# Altium schematic sheet uC.SchDoc
size A3; SheetNumber: 2; SheetTotal: 7
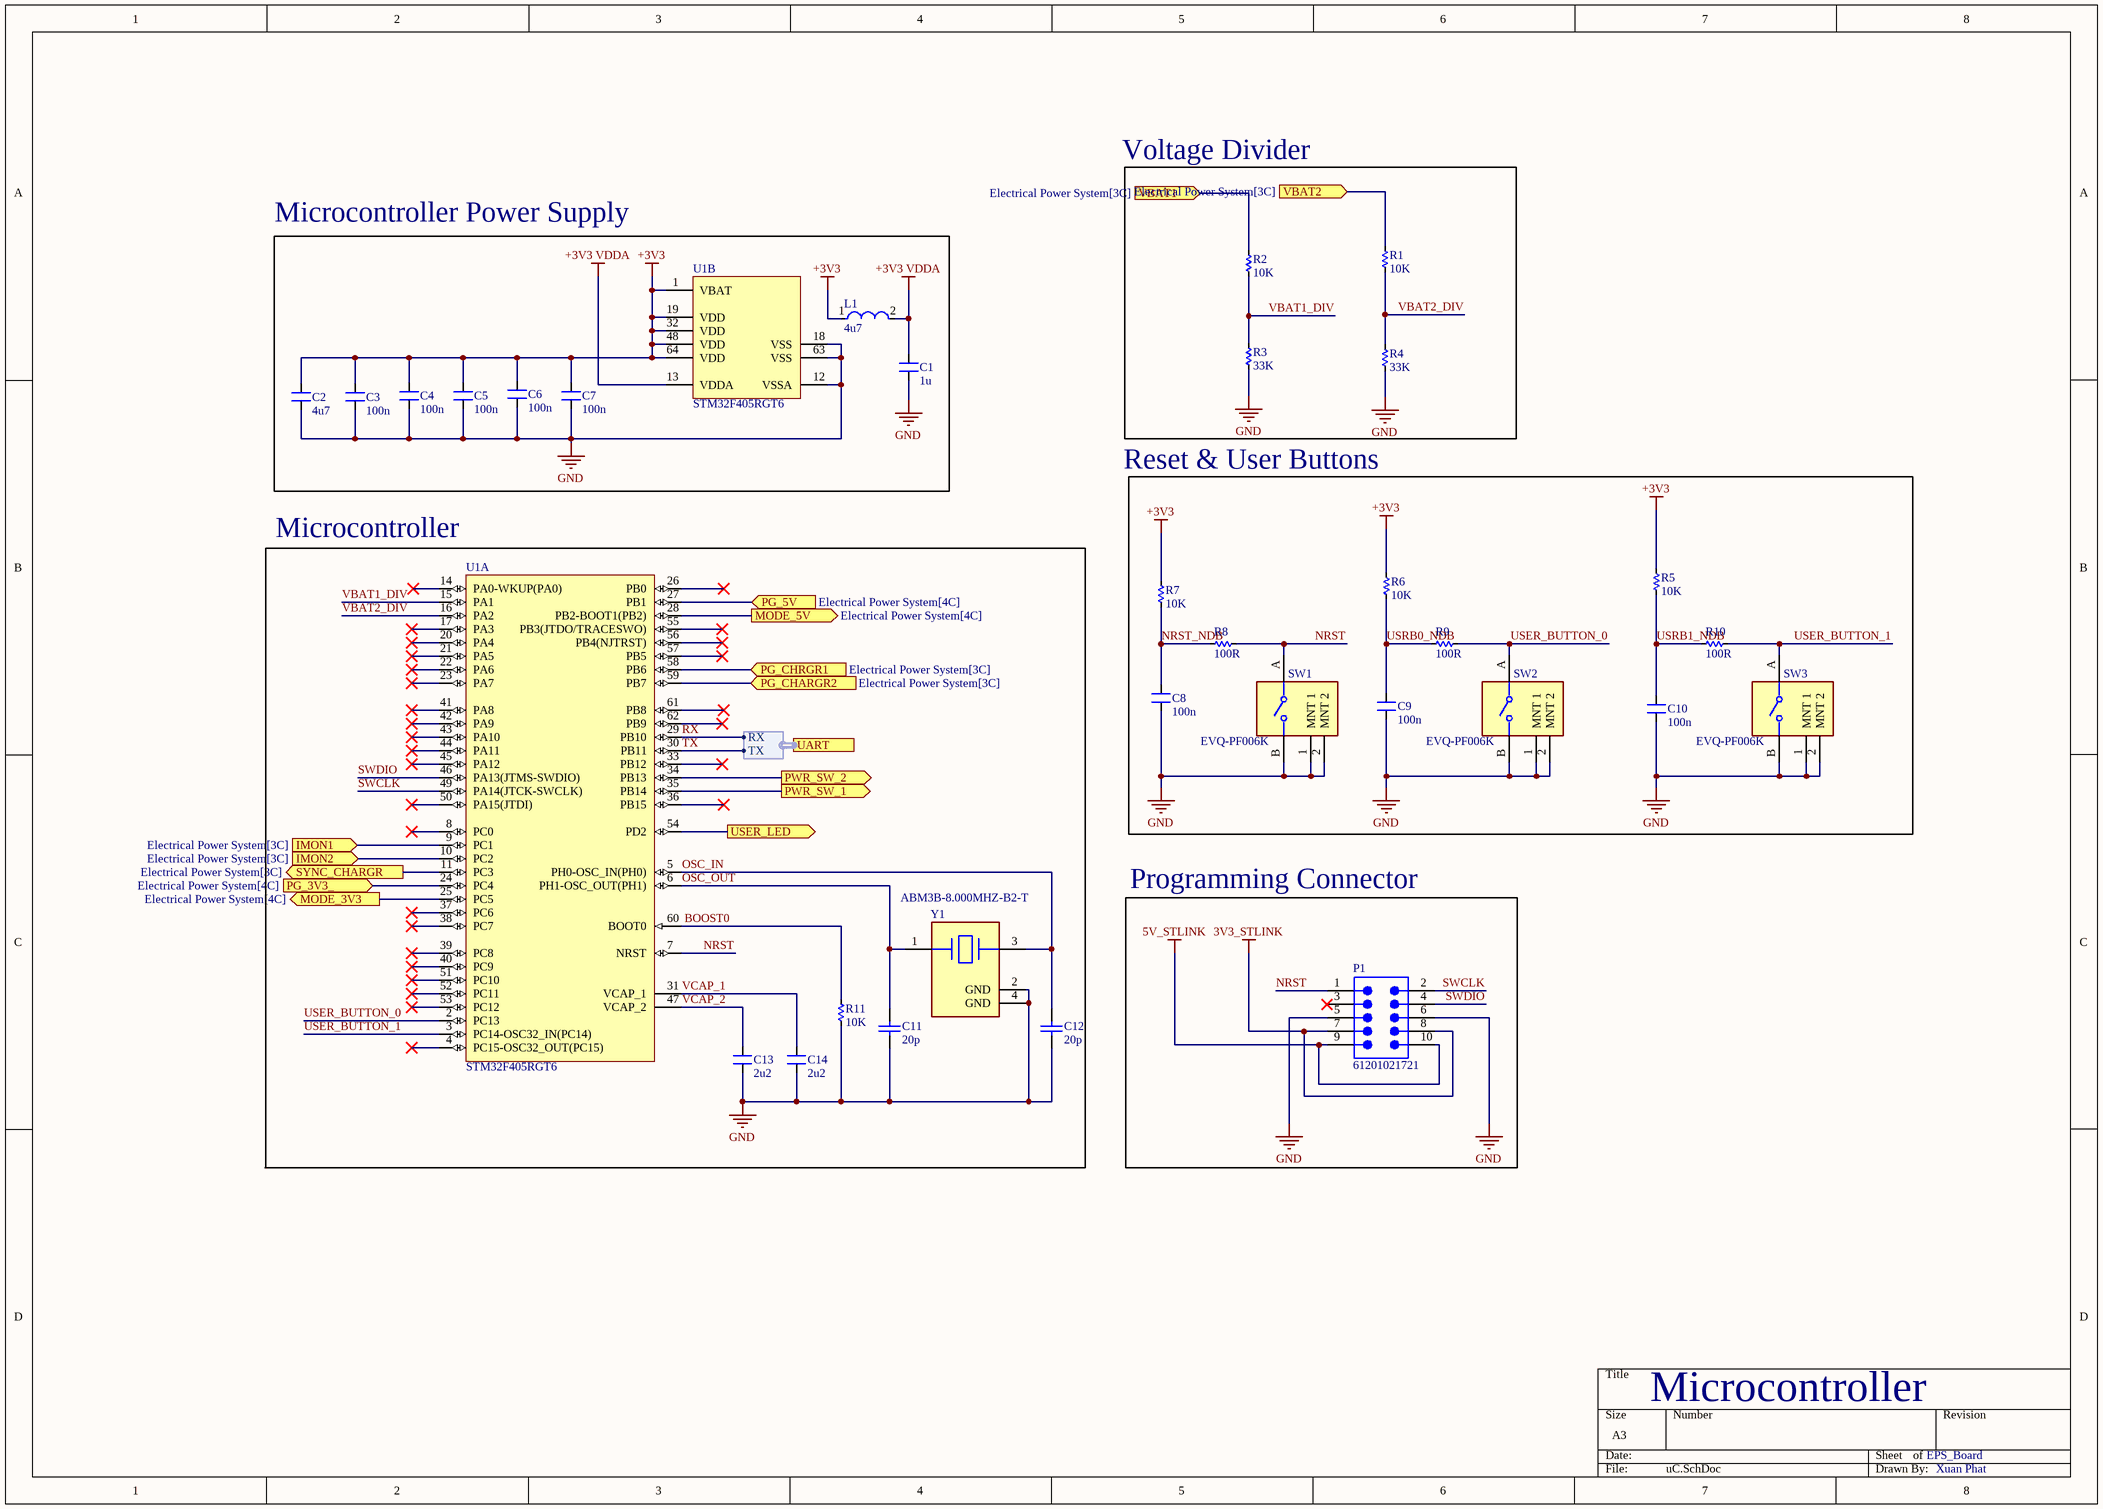
[diagram p0: uC.SchDoc]

## Parts
C1  1u  [CN-SMD-0603]
C2  4u7  [CN-SMD-0603]
C3  100n  [CN-SMD-0603]
C4  100n  [CN-SMD-0603]
C5  100n  [CN-SMD-0603]
C6  100n  [CN-SMD-0603]
C7  100n  [CN-SMD-0603]
C8  100n  [CN-SMD-0603]
C9  100n  [CN-SMD-0603]
C10  100n  [CN-SMD-0603]
C11  20p  [CAPC1608X90X30LL10T20]
C12  20p  [CAPC1608X90X30LL10T20]
C13  2u2  [CN-SMD-0603]
C14  2u2  [CN-SMD-0603]
L1  4u7  [FP-LQM2HPN_G0-IPC_A]
P1  61201021721  [61201021721]
R1  10K  [RES-SMD-0805]
R2  10K  [RES-SMD-0805]
R3  33K  [RES-SMD-0805]
R4  33K  [RES-SMD-0805]
R5  10K  [RES-SMD-0805]
R6  10K  [RES-SMD-0805]
R7  10K  [RES-SMD-0805]
R8  100R  [RES-SMD-0805]
R9  100R  [RES-SMD-0805]
R10  100R  [RES-SMD-0805]
R11  10K  [RES-SMD-0805]
SW1  EVQ-PF006K  [FP-EVQ-PF006K-MFG]
SW2  EVQ-PF006K  [FP-EVQ-PF006K-MFG]
SW3  EVQ-PF006K  [FP-EVQ-PF006K-MFG]
U1  STM32F405RGT6  [STM-LQFP64_M]  (parts A,B of 2)
Y1  ABM3B-8.000MHZ-B2-T  [FP-ABM3B-MFG]

## Blocks framed on the sheet
Voltage Divider: R1-R4
Microcontroller Power Supply: C1-C7 L1 U1
Microcontroller: C11-C14 R11 U1 Y1
Programming Connector: P1

## Ports
IMON1 (in, see Electrical Power System[3C]), IMON2 (in, see Electrical Power System[3C]), MODE_3V3 (out, see Electrical Power System[4C]), MODE_5V (out, see Electrical Power System[4C]), PG_3V3_ (in, see Electrical Power System[4C]), PG_5V (in, see Electrical Power System[4C]), PG_CHARGR2 (in, see Electrical Power System[3C]), PG_CHRGR1 (in, see Electrical Power System[3C]), PWR_SW_1 (out, see Electrical Power System[4C], Peripherals[2B]), PWR_SW_2 (out, see Electrical Power System[4C], Peripherals[2C]), SYNC_CHARGR (out, see Electrical Power System[3C]), UART (harness *, see Electrical Power System[4C], Main connector[3C]), USER_LED (out, see Electrical Power System[4C], Peripherals[1B]), VBAT1 (in, see Electrical Power System[3C]), VBAT2 (in, see Electrical Power System[3C])

## Harnesses
*: RX, TX

## Nets
3V3_STLINK: P1.7 P1.8
5V_STLINK: P1.9 P1.10
+3V3: C2.2 C3.2 C4.2 C5.2 C6.2 C7.2 L1.1 R5.1 R6.1 R7.1 U1.1(VBAT) U1.19(VDD) U1.32(VDD) U1.48(VDD) U1.64(VDD)
+3V3 VDDA: C1.2 L1.2 U1.13(VDDA)
GND: C1.1 C2.1 C3.1 C4.1 C5.1 C6.1 C7.1 C8.1 C9.1 C10.1 C11.1 C12.1 C13.1 C14.1 P1.5 P1.6 R3.2 R4.2 R11.2 SW1.1(MNT_1) SW1.2(MNT_2) SW1.B SW2.1(MNT_1) SW2.2(MNT_2) SW2.B SW3.1(MNT_1) SW3.2(MNT_2) SW3.B U1.12(VSSA) U1.18(VSS) U1.63(VSS) Y1.2(GND) Y1.4(GND)
BOOST0: R11.1 U1.60(BOOT0)
IMON1: U1.9(PC1) ; port IMON1
IMON2: U1.10(PC2) ; port IMON2
MODE_3V3: U1.25(PC5) ; port MODE_3V3
MODE_5V: U1.28(PB2-BOOT1(PB2)) ; port MODE_5V
NRST: P1.1 R8.2 SW1.A U1.7(NRST)
NRST_NDB: C8.2 R7.2 R8.1
OSC_IN: C12.2 U1.5(PH0-OSC_IN(PH0)) Y1.3
OSC_OUT: C11.2 U1.6(PH1-OSC_OUT(PH1)) Y1.1
PG_3V3_: U1.24(PC4) ; port PG_3V3_
PG_5V: U1.27(PB1) ; port PG_5V
PG_CHARGR2: U1.59(PB7) ; port PG_CHARGR2
PG_CHRGR1: U1.58(PB6) ; port PG_CHRGR1
PWR_SW_1: U1.35(PB14) ; port PWR_SW_1
PWR_SW_2: U1.34(PB13) ; port PWR_SW_2
RX: U1.29(PB10) ; port UART.RX
SWCLK: P1.2 U1.49(PA14(JTCK-SWCLK))
SWDIO: P1.4 U1.46(PA13(JTMS-SWDIO))
SYNC_CHARGR: U1.11(PC3) ; port SYNC_CHARGR
TX: U1.30(PB11) ; port UART.TX
USER_BUTTON_0: R9.2 SW2.A U1.2(PC13)
USER_BUTTON_1: R10.2 SW3.A U1.3(PC14-OSC32_IN(PC14))
USER_LED: U1.54(PD2) ; port USER_LED
USRB0_NDB: C9.2 R6.2 R9.1
USRB1_NDB: C10.2 R5.2 R10.1
VBAT1: R2.1 ; port VBAT1
VBAT1_DIV: R2.2 R3.1 U1.15(PA1)
VBAT2: R1.1 ; port VBAT2
VBAT2_DIV: R1.2 R4.1 U1.16(PA2)
VCAP_1: C14.2 U1.31(VCAP_1)
VCAP_2: C13.2 U1.47(VCAP_2)

Not connected (* = marked no-connect by the designer): P1 3*; U1 4(PC15-OSC32_OUT(PC15))* 8(PC0)* 14(PA0-WKUP(PA0))* 17(PA3)* 20(PA4)* 21(PA5)* 22(PA6)* 23(PA7)* 26(PB0)* 33(PB12)* 36(PB15)* 37(PC6)* 38(PC7)* 39(PC8)* 40(PC9)* 41(PA8)* 42(PA9)* 43(PA10)* 44(PA11)* 45(PA12)* 50(PA15(JTDI))* 51(PC10)* 52(PC11)* 53(PC12)* 55(PB3(JTDO/TRACESWO))* 56(PB4(NJTRST))* 57(PB5)* 61(PB8)* 62(PB9)*

## Notes on the sheet
- Reset & User Buttons
- Microcontroller
- EPS_Board
- Xuan Phat

## Library data of the parts
C1-C10 C13 C14 = Capacitors: Value: 33pF
C11 C12 = CMP-2000-06100-1: Chip Capacitor, 20 pF, +/- 5%, 50 V, -55 to 85 degC, 0603 (1608 Metric), RoHS, Tape and Reel; Manufacturer: Samsung Electro-Mechanics; Dielectric: C0G; Rated Voltage: 50V; Capacitance: 20pF; Tolerance (%): ±5%; Case Size/Dimension: 0603; Datasheet Version: 06/2016; Manufacturer URL: http://www.samsungsem.com/global/index.jsp; Datasheet URL: http://www.samsungsem.com/kr/support/product-search/mlcc/__icsFiles/afieldfile/2016/08/18/S_CL10C200JB8NNNC.pdf; Mounting Technology: SurfaceMount; Package Description: 2-Pin Surface Mount Device, Body 1.60 x 0.80 mm; Package Reference: 0603
L1 = CMP-06042-016771-1: Multilayer Type Inductor for Power Lines, 1008 (2520), 4.7μH, 20%, 0.138Ω, 1.1A; Shielding: Shielded; DC Resistance (DCR): 110mR; Core Material: Ferrite; Test Frequency: 1MHz; Inductance: 4.7uH; Self Resonant Frequency: 25MHz; Max DC Current: 1.1A; REACH SVHC: No SVHC; Series: LQM2HP_G0; Case Code (Metric): 2520; Current Rating: 1.1A; Packaging: Tape and Reel; Tolerance: 20%; Military Standard: Not; Min Operating Temperature: -55°C; RoHS Compliant: Yes; Width: 0.079inch; Depth: 2.2mm; Max Operating Temperature: 125°C; Package Quantity: 3000; Mount: Surface Mount; Termination: SMD/SMT; Height: 1.2mm; Case/Package: 1008; Rated Current-Max: 1.1A; Height - Seated (Max): 0.039inch; Case Code (Imperial): 1008; Radiation Hardening: No; Lead Free: Lead Free; DC Current: 1.1A; Length: 2.5mm; Inductance Tolerance: 20%
P1 = CMP-1502-00021-2: NexarPartId: 8917787; Operating Supply Voltage: 250V; Number of Positions: 10; Contact Resistance: 20mΩ; Connector Type: Male Pin; Current Rating: 3A; Pitch: 2.54mm; Gender: Male; Insulation Resistance: 1GΩ; Insulation: Insulated; Max Operating Temperature: 105°C; Flammability Rating: UL94 V-0; Mount: Through Hole; Contact Material: Copper; Min Operating Temperature: -40°C; Length: 20.36mm; Number of Contacts: 10; Height: 8.85mm; Number of Rows: 2; Housing Material: PBT; Color: Black; Contact Gender: Male; Orientation: Right Angle; Contact Plating: Gold; Number of Pins: 10; Voltage Rating (DC): 250V; RoHS: Compliant; Insulation Material: PBT; REACH SVHC: Unknown; Row Spacing: 2.54mm; Voltage Rating: 250V; Width: 20.36mm; Lead Pitch: 2.54mm; Termination: Through Hole
R1-R11 = Res SMD: SMD; Manufacturer: Generic Components; Class: Passive; Published: 08/06/2000; Publisher: Altium Hobart Technology Centre
SW1-SW3 = CMP-00287-39802768-1: EVQ-PF006K Switch Tactile N.O. SPST Round Button PC Pins 0.02A 15VDC 1N Thru-Hole Bulk; Voltage Rating (DC): 15V; Current Rating: 20mA; Actuator Length: 5.85mm; Life (Cycles): 100kcycles; Number of Positions: 2; Switch Function: Off-Mom; Switch Travel: 250µm; Contact Resistance: 50mΩ; Illumination Type: Illuminated, Non-Illuminated; NexarPartId: 39802768; Max Current Rating: 20mA; Color: Black; Height: 7.1mm; Throw Configuration: SPST; Width: 4mm; Packaging: Bulk; Mount: Through Hole; Operating Force: 1N; Lead Free: Lead Free; Contact Current Rating: 20mA; Length: 6.2mm; Max Operating Temperature: 70°C; Min Operating Temperature: -20°C; Contact Plating: Gold, Silver; Orientation: Right Angle; REACH SVHC: No SVHC; Termination: PC Pins; Mechanical Life: 100kcycles; Radiation Hardening: No; Electrical Life: 100kcycles; RoHS: Compliant; Max Voltage Rating (DC): 15V; Depth: 9.85mm
U1 = CMP-0243-00019-3: ARM Cortex-M4 32-bit MCU+FPU, 210 DMIPS, 1024 kB Flash, 192 kB Internal RAM, 51 I/Os, 64-pin LQFP, -40 to 85 degC, Tray; Manufacturer: STMicroelectronics; Supply Voltage(Vcc) min (V): 1.8; Supply Voltage(Vcc) max (V): 3.6; Internal RAM Size (kB): 192; I/Os (High Current): 51; D/A Converter: 2x12-bit; FLASH Size (Prog) (kB): 1024; Operating Frequency(F) (Processor speed) (MHz): 168; ComponentLink2Description: Datasheet; PackageVersion: Rev. 4, 06/2013; DatasheetVersion: Rev. 4; Core: ARM Cortex-M4; ComponentLink2URL: http://www.st.com/st-web-ui/static/active/en/resource/technical/document/datasheet/DM00037051.pdf; PackageReference: LQFP64; Packing: Tray; ComponentLink1Description: Manufacturer URL; ComponentLink3URL: http://www.st.com/st-web-ui/static/active/en/resource/technical/document/datasheet/DM00037051.pdf; ComponentLink3Description: Package Specification; Mounting Technology: Surface Mount; ComponentLink1URL: http://www.st.com/web/en/home.html; PackageDescription: 64-Pin Low Profile Quad Flat Package, 10 x 10 mm Body, 0.5 mm Pitch; PartNumber: STM32F405RGT6
Y1 = CMP-1688-00002-2: Crystal 8MHz ±20ppm 18pF SMD-4 5mm x 3.2mm; ESR (Equivalent Series Resistance): 200R; Frequency Stability: 50ppm; Operating Frequency: 8 MHz; Mount: Surface Mount; Number of Pins: 4; Packaging: Tape and Reel; Width: 0.126inch; Case/Package: CSMD; Lead Free: Lead Free; Depth: 3.2mm; Load Capacitance: 18pF; Min Operating Temperature: -20°C; Series: ABM3B; Package Quantity: 1000; Resistor Type: Ceramic; Height: 0.043inch; Max Operating Temperature: 70°C; Frequency Tolerance: 20ppm; Series Resistance: 200R; Tolerance: 20ppm; Termination: SMD/SMT; Length: 5mm; Frequency: 8MHz